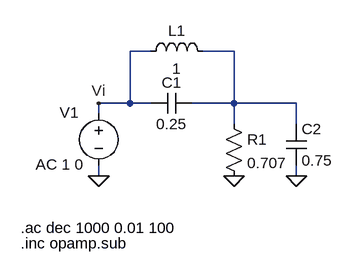
[diagram p0: schematic LPN_Pasivo.asc]
LPN_Pasivo.asc, the LTspice schematic file:
Version 4
SHEET 1 1328 680
WIRE 448 -96 416 -96
WIRE 576 -96 528 -96
WIRE 416 -16 416 -96
WIRE 416 -16 368 -16
WIRE 448 -16 416 -16
WIRE 576 -16 576 -96
WIRE 576 -16 512 -16
WIRE 672 -16 576 -16
WIRE 368 0 368 -16
WIRE 576 16 576 -16
WIRE 672 16 672 -16
WIRE 368 96 368 80
WIRE 672 96 672 80
FLAG 368 96 0
FLAG 368 -16 Vi
FLAG 576 96 0
FLAG 672 96 0
SYMBOL voltage 368 -16 R0
WINDOW 123 -97 94 Left 2
WINDOW 39 0 0 Left 0
WINDOW 0 -60 14 Left 2
SYMATTR Value2 AC 1 0
SYMATTR InstName V1
SYMATTR Value ""
SYMBOL cap 512 -32 R90
WINDOW 0 0 32 VBottom 2
WINDOW 3 32 32 VTop 2
SYMATTR InstName C1
SYMATTR Value 0.25
SYMBOL ind 432 -80 R270
WINDOW 0 32 56 VTop 2
WINDOW 3 5 56 VBottom 2
SYMATTR InstName L1
SYMATTR Value 1
SYMBOL res 560 0 R0
SYMATTR InstName R1
SYMATTR Value 0.707
SYMBOL cap 656 16 R0
SYMATTR InstName C2
SYMATTR Value 0.75
TEXT 248 200 Left 2 !.inc opamp.sub
TEXT 248 176 Left 2 !.ac dec 1000 0.01 100

The netlist it stands for:
* LPN_Pasivo.asc
V1 Vi 0 AC 1 0
C1 N001 Vi 0.25
L1 Vi N001 1
R1 N001 0 0.707
C2 N001 0 0.75
.inc opamp.sub
.ac dec 1000 0.01 100
.backanno
.end